# EAGLE design Sedna Power Board v2 (EAGLE 9.6.1)
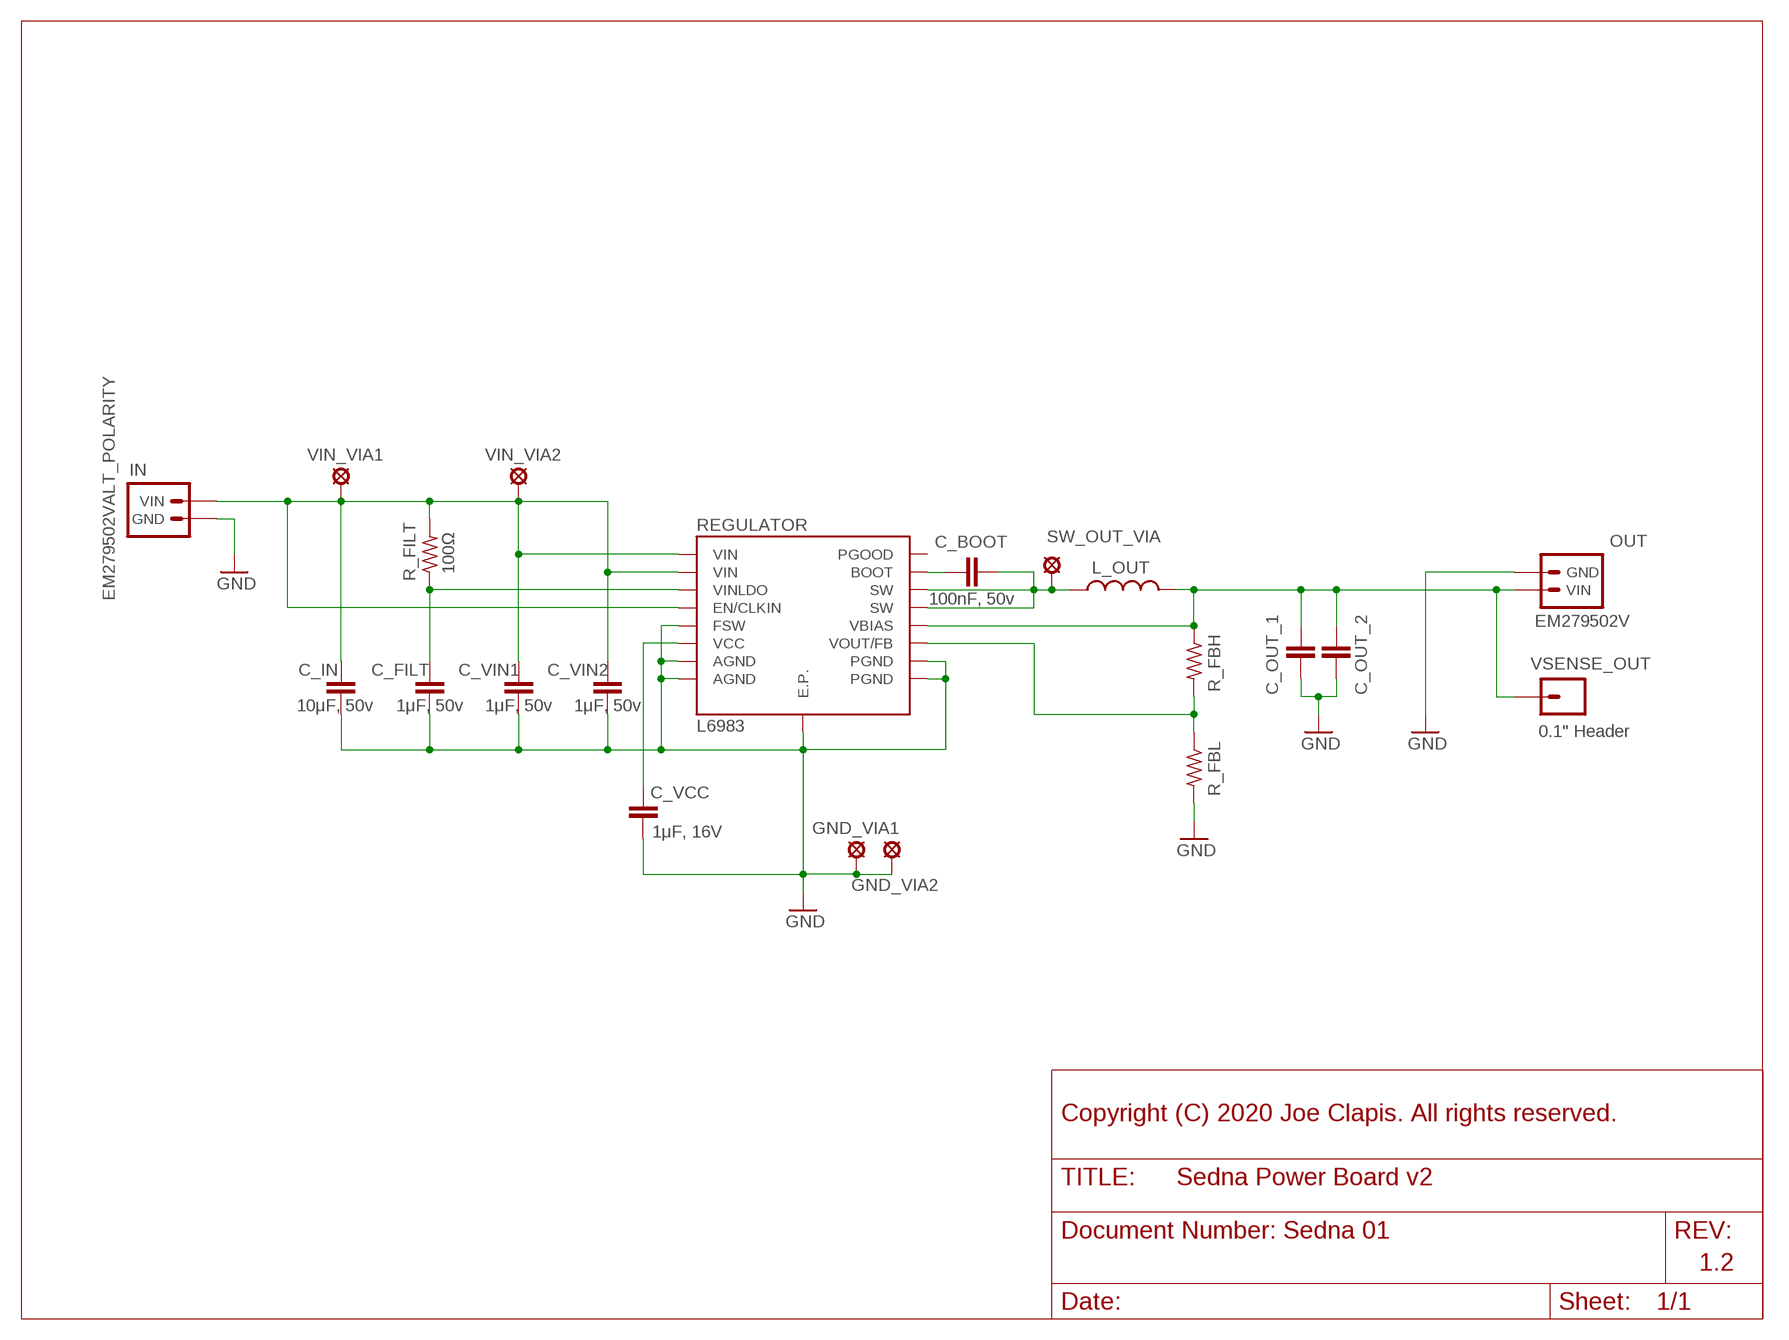
[diagram p0: schematic, sheet 1]

## Parts
C_BOOT  100nF, 50v  C-EUC0805  [C0805]
C_FILT  1μF, 50v  C-EUC0805  [C0805]
C_IN  10μF, 50v  C-EUC1206  [C1206]
C_OUT_1  TDK_C2220_5750  [TDK_C2220_5750]
C_OUT_2  TDK_C2220_5750  [TDK_C2220_5750]
C_VCC  1μF, 16V  C-EUC0805  [C0805]
C_VIN1  1μF, 50v  C-EUC0805  [C0805]
C_VIN2  1μF, 50v  C-EUC0805  [C0805]
GND_VIA1  LSP13  [LSP13]
GND_VIA2  LSP13  [LSP13]
IN  EM279502VALT_POLARITY  [EM279502V]
L_OUT  PA4343_FP2  [PA4343_FP2]
OUT  EM279502V  [EM279502V]
R_FBH  R-US_R0805  [R0805]
R_FBL  R-US_R0805  [R0805]
R_FILT  100Ω  R-US_R0805  [R0805]
REGULATOR  L6983  [L6983]
SW_OUT_VIA  LSP13  [LSP13]
VIN_VIA1  LSP13  [LSP13]
VIN_VIA2  LSP13  [LSP13]
VSENSE_OUT  0.1" Header  M01PTH  [1X01]

## Nets
C_BOOT: C_BOOT.1 REGULATOR.11_BOOT(BOOT)
FB: R_FBH.2 R_FBL.1 REGULATOR.7_FB/VOUT(VOUT/FB)
GND: C_FILT.2 C_IN.2 C_OUT_1.2 C_OUT_2.2 C_VCC.2 C_VIN1.2 C_VIN2.2 GND_VIA1.MP GND_VIA2.MP IN.1A(GND) IN.1B(GND) OUT.2A(GND) OUT.2B(GND) R_FBL.2 REGULATOR.3_AGND(AGND) REGULATOR.8_FSW(FSW) REGULATOR.10_AGND(AGND) REGULATOR.13_PGND(PGND) REGULATOR.16_PGND(PGND) REGULATOR.E.P.
SW_OUT: C_BOOT.2 L_OUT.1 REGULATOR.14_SW(SW) REGULATOR.15_SW(SW) SW_OUT_VIA.MP
V_IN: C_IN.1 C_VIN1.1 C_VIN2.1 IN.2A(VIN) IN.2B(VIN) R_FILT.2 REGULATOR.1_VIN(VIN) REGULATOR.4_EN/CLKIN(EN/CLKIN) REGULATOR.12_VIN(VIN) VIN_VIA1.MP VIN_VIA2.MP
V_OUT: C_OUT_1.1 C_OUT_2.1 L_OUT.2 OUT.1A(VIN) OUT.1B(VIN) R_FBH.1 REGULATOR.6_VBIAS(VBIAS) VSENSE_OUT.1
VCC: C_VCC.1 REGULATOR.9_VCC(VCC)
VINLDO: C_FILT.1 R_FILT.1 REGULATOR.2_VINLDO(VINLDO)
Unconnected: REGULATOR.5_PGOOD(PGOOD)

## Notes on the sheet
- Copyright (C) 2020 Joe Clapis. All rights reserved.
- Sedna 01
- 1.2

## Library data of the parts
C_BOOT C_FILT C_IN C_VCC C_VIN1 C_VIN2 = rcl:C-EU: CAPACITOR, European symbol; SPICEPREFIX: C
C_OUT_1 C_OUT_2 = Sedna Components:TDK_C2220_5750
GND_VIA1 GND_VIA2 SW_OUT_VIA VIN_VIA1 VIN_VIA2 = solpad:LSP13: SOLDER PAD drill 1.3 mm, distributor Buerklin, 12H562
IN OUT = Sedna Components:EM279502V
L_OUT = Sedna Components:PA4343_FP2: The Pulse PA4343.XXXNLT is a series of shielded SMT power inductors: https://www.mouser.com/datasheet/2/336/P770-1526930.pdf
R_FBH R_FBL R_FILT = rcl:R-US_: RESISTOR, American symbol; SPICEPREFIX: R
REGULATOR = Sedna Components:L6983: The L6983 is a configurable DC-DC step-down regulator, bringing 3.5-38V down to 0.85-Vin. It supports up to 3A of output current, and comes in a QFN16 package. https://my.st.com/resource/en/datasheet/l6983.pdf; SPICEPREFIX: X
VSENSE_OUT = SparkFun-Connectors:M01: Header 1 Standard 1-pin 0.1" header. Use with straight break away headers (SKU : PRT-00116), right angle break away headers (PRT-00553), swiss pins (PRT-00743), machine pins (PRT-00117), and female headers (PRT-00115). SMTSO-256-ET is a "flush mount" nut for a 4-40 screw. The older package used to be too tight, and did not allow it to sit properly thru the drill hit. The latest (0.165DIA) fits nice and snug.

## Board
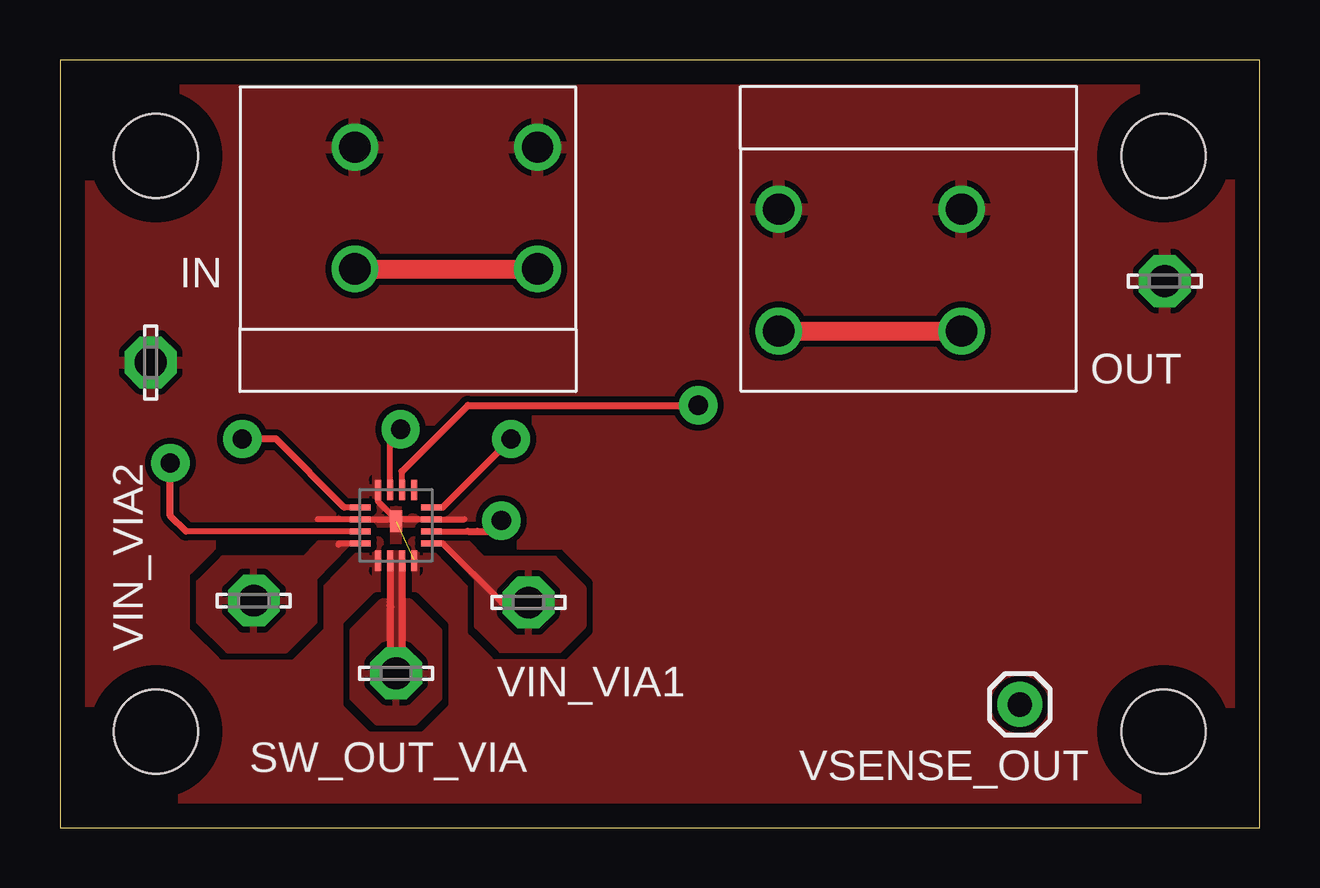
[diagram p1: board, top side]
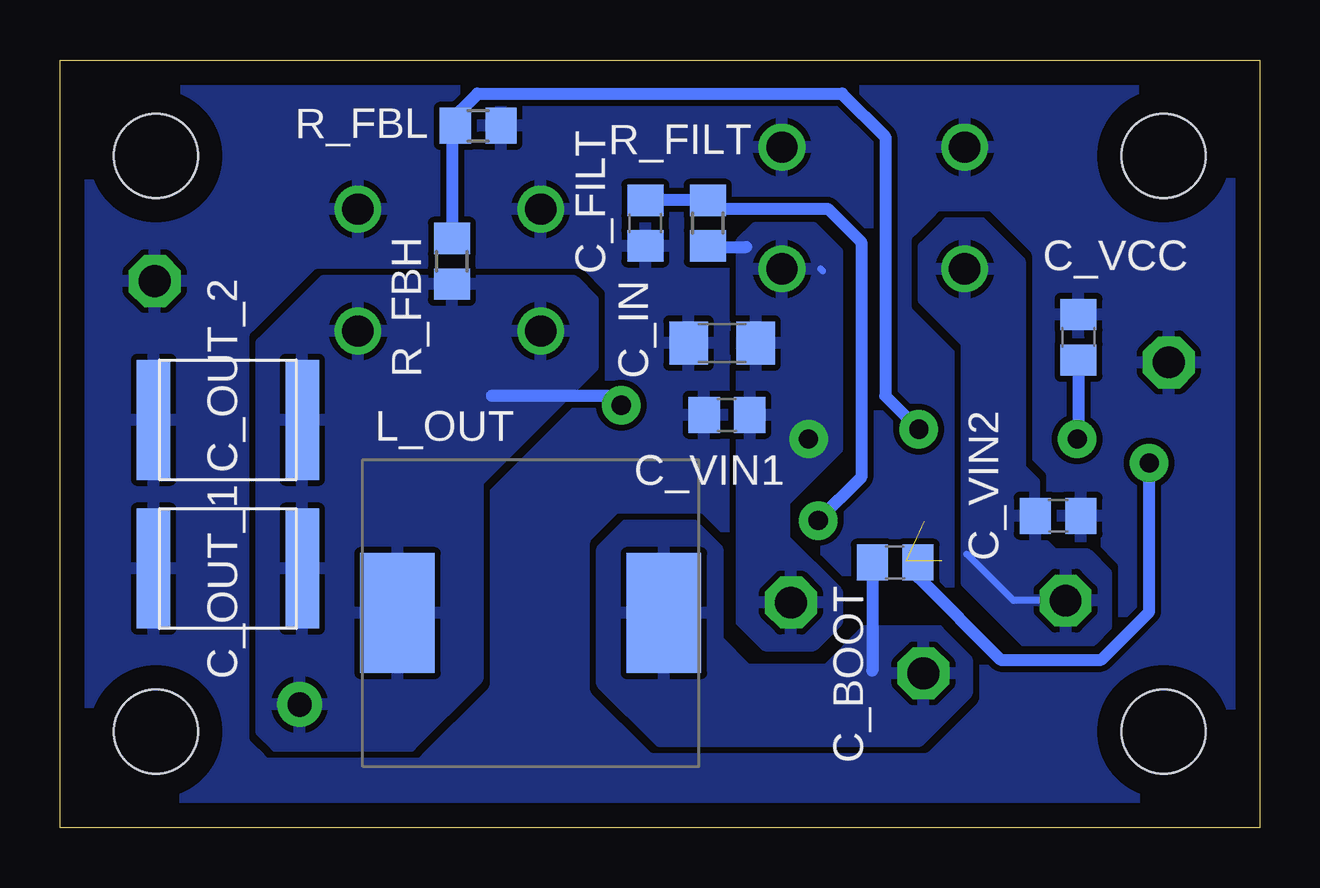
[diagram p2: board, bottom side, seen from below]

Size 50 x 32 mm. Coordinates in mm from the lower left corner, seen from the top.
Outline: 0,0 50,0 50,32 0,32 0,0
Copper layers (1*16): Top 0.035mm / dielectric 1.5mm / Bottom 0.035mm
Design rules "default": minimum track width 6mil, minimum drill 0.35mm, track to track 6mil, track to pad 6mil, pad to pad 6mil, via to via 6mil, smd to smd 6mil, copper to edge 40mil, drill to drill 6mil, minimum pad ring 10mil, minimum via ring 8mil, stop-mask expansion 4mil, vias tented up to drill 0mil, thermal gap 10mil
Holes 3.5 mm at 4,4 4,28 46,28 46,4

### Footprints (pad centres in the part's own frame; a part is rotated, then mirrored left to right if it is on the bottom)
C0805 = smd 1.3 x 1.5: 1 -0.95,0; 2 0.95,0
C1206 = smd 1.6 x 1.8: 1 -1.4,0; 2 1.4,0
TDK_C2220_5750 = smd 1.4 x 5: 1 -3.1,0; 2 3.1,0
LSP13 = drill 1.321 pad 2.159 octagon: MP 0,0
EM279502V = drill 1.3: 1A -2.54,-3.81; 1B -2.54,3.81; 2A 2.54,-3.81; 2B 2.54,3.81
PA4343_FP2 = smd 5 x 3.1: 1 0,5.55; 2 0,-5.55
R0805 = smd 1.3 x 1.5: 1 -0.95,0; 2 0.95,0
L6983 = smd 0.85 x 0.25: 1_VIN 1.475,-0.75; 2_VINLDO 1.475,-0.25; 3_AGND 1.475,0.25; 4_EN/CLKIN 1.475,0.75; 9_VCC -1.475,0.75; 10_AGND -1.475,0.25; 11_BOOT -1.475,-0.25; 12_VIN -1.475,-0.75 | smd 0.25 x 0.85: 5_PGOOD 0.75,1.475; 6_VBIAS 0.25,1.475; 7_FB/VOUT -0.25,1.475; 8_FSW -0.75,1.475; 13_PGND -0.75,-1.475; 14_SW -0.25,-1.475; 15_SW 0.25,-1.475; 16_PGND 0.75,-1.475 | smd 0.5 x 0.9: E.P. 0,0.17
1X01 = drill 1.016 pad 1.88: 1 0,0

### Placement (x,y rotation side)
C_BOOT  15.19,11.05 180 bottom
C_FILT  25.6,25.2 270 bottom
C_IN  22.4,20.2 180 bottom
C_OUT_1  43,10.8 180 bottom
C_OUT_2  43,17 180 bottom
C_VCC  7.55,20.44 90 bottom
C_VIN1  22.2,17.2 180 bottom
C_VIN2  8.4,13 0 bottom
GND_VIA1  3.78,19.39 270 top
GND_VIA2  46.05,22.78 0 top
IN  16.1,25.83 270 top
L_OUT  30.38,8.94 270 bottom
OUT  33.77,23.24 90 top
R_FBH  33.66,23.61 90 bottom
R_FBL  32.57,29.26 0 bottom
R_FILT  23,25.2 270 bottom
REGULATOR  14,12.6 0 top
SW_OUT_VIA  14.01,6.43 0 top
VIN_VIA1  19.53,9.38 0 top
VIN_VIA2  8.08,9.46 0 top
VSENSE_OUT  40.01,5.13 0 top

### Tracks (layer width: path | path; a pad name or v marks a point on that pad's centre or on a via)
C_BOOT  (via drill 0.8 pad 1.6)
  Top 0.25: REGULATOR.11_BOOT 5.25,12.35
  Top 0.3: 5.25,12.35 4.6,13 v4.6,15.2
  Bottom 0.5: C_BOOT.1 14.24,10.44 10.8,7 6.6,7 4.6,9 v4.6,15.2
FB  (via drill 0.8 pad 1.6)
  Top 0.25: REGULATOR.7_FB/VOUT 13.75,16.15
  Top 0.3: 13.75,16.15 v14.2,16.6
  Bottom 0.3: R_FBL.1 33.66,29.29
  Bottom 0.5: 33.66,29.29 R_FBH.2 | R_FBL.1 33.86,29.34 32.6,30.6 17.4,30.6 15.6,28.8 15.6,18 v14.2,16.6
GND  (2 unrouted)
  Top 0.25: 14,12.85 REGULATOR.3_AGND 16.85,12.85 | 14,12.85 13.92,12.85 REGULATOR.10_AGND 10.75,12.85 | REGULATOR.8_FSW 13.25,13.6 14,12.85
  Top 0.3: 13.92,12.85 REGULATOR.E.P.
  pour Top (isolate 0.25, rank 2): 0,32 0,0 50,0 50,32
  pour Bottom (isolate 0.25, rank 2): 0,32 0,0 50,0 50,32
SW_OUT
  Top 0.3: 13.75,9.25 13.8,9.2 | REGULATOR.15_SW 14.25,6.65 14,6.4 13.75,6.65 REGULATOR.14_SW
  Bottom 0.5: C_BOOT.2 16.14,6.54
  pour Bottom: 12.2,7 12.2,5.6 14.2,3.6 25,3.6 27.4,6 27.4,11.6 26.4,12.6 23.6,12.6 22.6,11.6 22.6,7.8 21.4,6.6 18,6.6 16.4,8.2 13.4,8.2
  pour Top: 13.2,4.4 14.8,4.4 15.8,5.4 15.8,8.2 14.6,9.4 13.4,9.4 12.2,8.2 12.2,5.4
  pour Top (no thermals): 13.75,11.2 13.75,9.4 14.25,9.4 14.25,11.4 13.8,11.4
V_IN  (via drill 0.8 pad 1.6)
  Top 0.25: REGULATOR.4_EN/CLKIN 15.95,13.35 | REGULATOR.1_VIN 15.95,11.85 18.42,9.38 | REGULATOR.12_VIN 11.65,11.85 11.6,11.8
  Top 0.3: 15.95,13.35 v18.8,16.2 | VIN_VIA1.MP 18.42,9.38
  Top 0.8: IN.2A IN.2B
  Bottom 0.3: VIN_VIA2.MP 10.26,9.46 12.2,11.4 | 18.2,23.2 18.29,23.29
  Bottom 0.5: R_FILT.2 22.95,24.2 21.4,24.2
  pour Bottom: 8.6,11.4 7.2,11.4 6.4,10.6 6.4,8.4 7,7.8 9.8,7.8 12.2,10.2 12.2,20.2 14,22 14,24.2 13,25.2 11.6,25.2 10,23.6 10,15 9.4,14.4 9.4,12.2
  pour Bottom: 18.6,25 21,25 21.6,24.4 21.6,8.6 20.6,7.6 18.6,7.6 17.6,8.6 17.6,9.8 19.8,12 19.8,13.6 17.6,15.8 17.6,24
  pour Top: 17.4,11.2 20.6,11.2 21.8,10 21.8,8.4 20.8,7.4 18.4,7.4 17.4,8.4
  pour Top (no thermals): 16,11.82 17,11.82 18.36,10.4 17.36,10.4
  pour Top: 7,7.4 9.4,7.4 10.6,8.6 10.6,11.2 6.8,11.2 5.8,10.2 5.8,8.6
  pour Top (no thermals): 11.96,11.82 10.8,11.82 9.44,10.4 10.6,10.4
V_OUT  (via drill 0.8 pad 1.6)
  Top 0.25: REGULATOR.6_VBIAS 14.25,14.85
  Top 0.3: v26.6,17.6 17,17.6 14.25,14.85
  Top 0.8: OUT.1B OUT.1A
  Bottom 0.5: v26.6,17.6 27,18 32,18
  pour Bottom: 32.6,14.4 32.6,6.2 35.4,3.4 41,3.4 41.6,4 41.6,20.2 39,22.8 28.6,22.8 27.8,22 27.8,19.2
VCC  (via drill 0.8 pad 1.6)
  Top 0.25: REGULATOR.9_VCC 11.85,13.35
  Top 0.3: 11.85,13.35 9,16.2 v7.6,16.2
  Bottom 0.5: C_VCC.1 7.55,16.25 v7.6,16.2
VINLDO  (via drill 0.8 pad 1.6)
  Top 0.25: REGULATOR.2_VINLDO 17,12.35
  Top 0.3: 17,12.35 17.4,12.35 17.95,12.35 v18.4,12.8
  Bottom 0.5: v18.4,12.8 16.6,14.6 16.6,24.4 18,25.8 22.65,25.8 R_FILT.1 C_FILT.1

### Text on the board
tDocu: + | - | Sedna Power / Board v2.0.2